# EAGLE schematic proxmark3 (EAGLE 6.4)

## Sheet 1 of 5
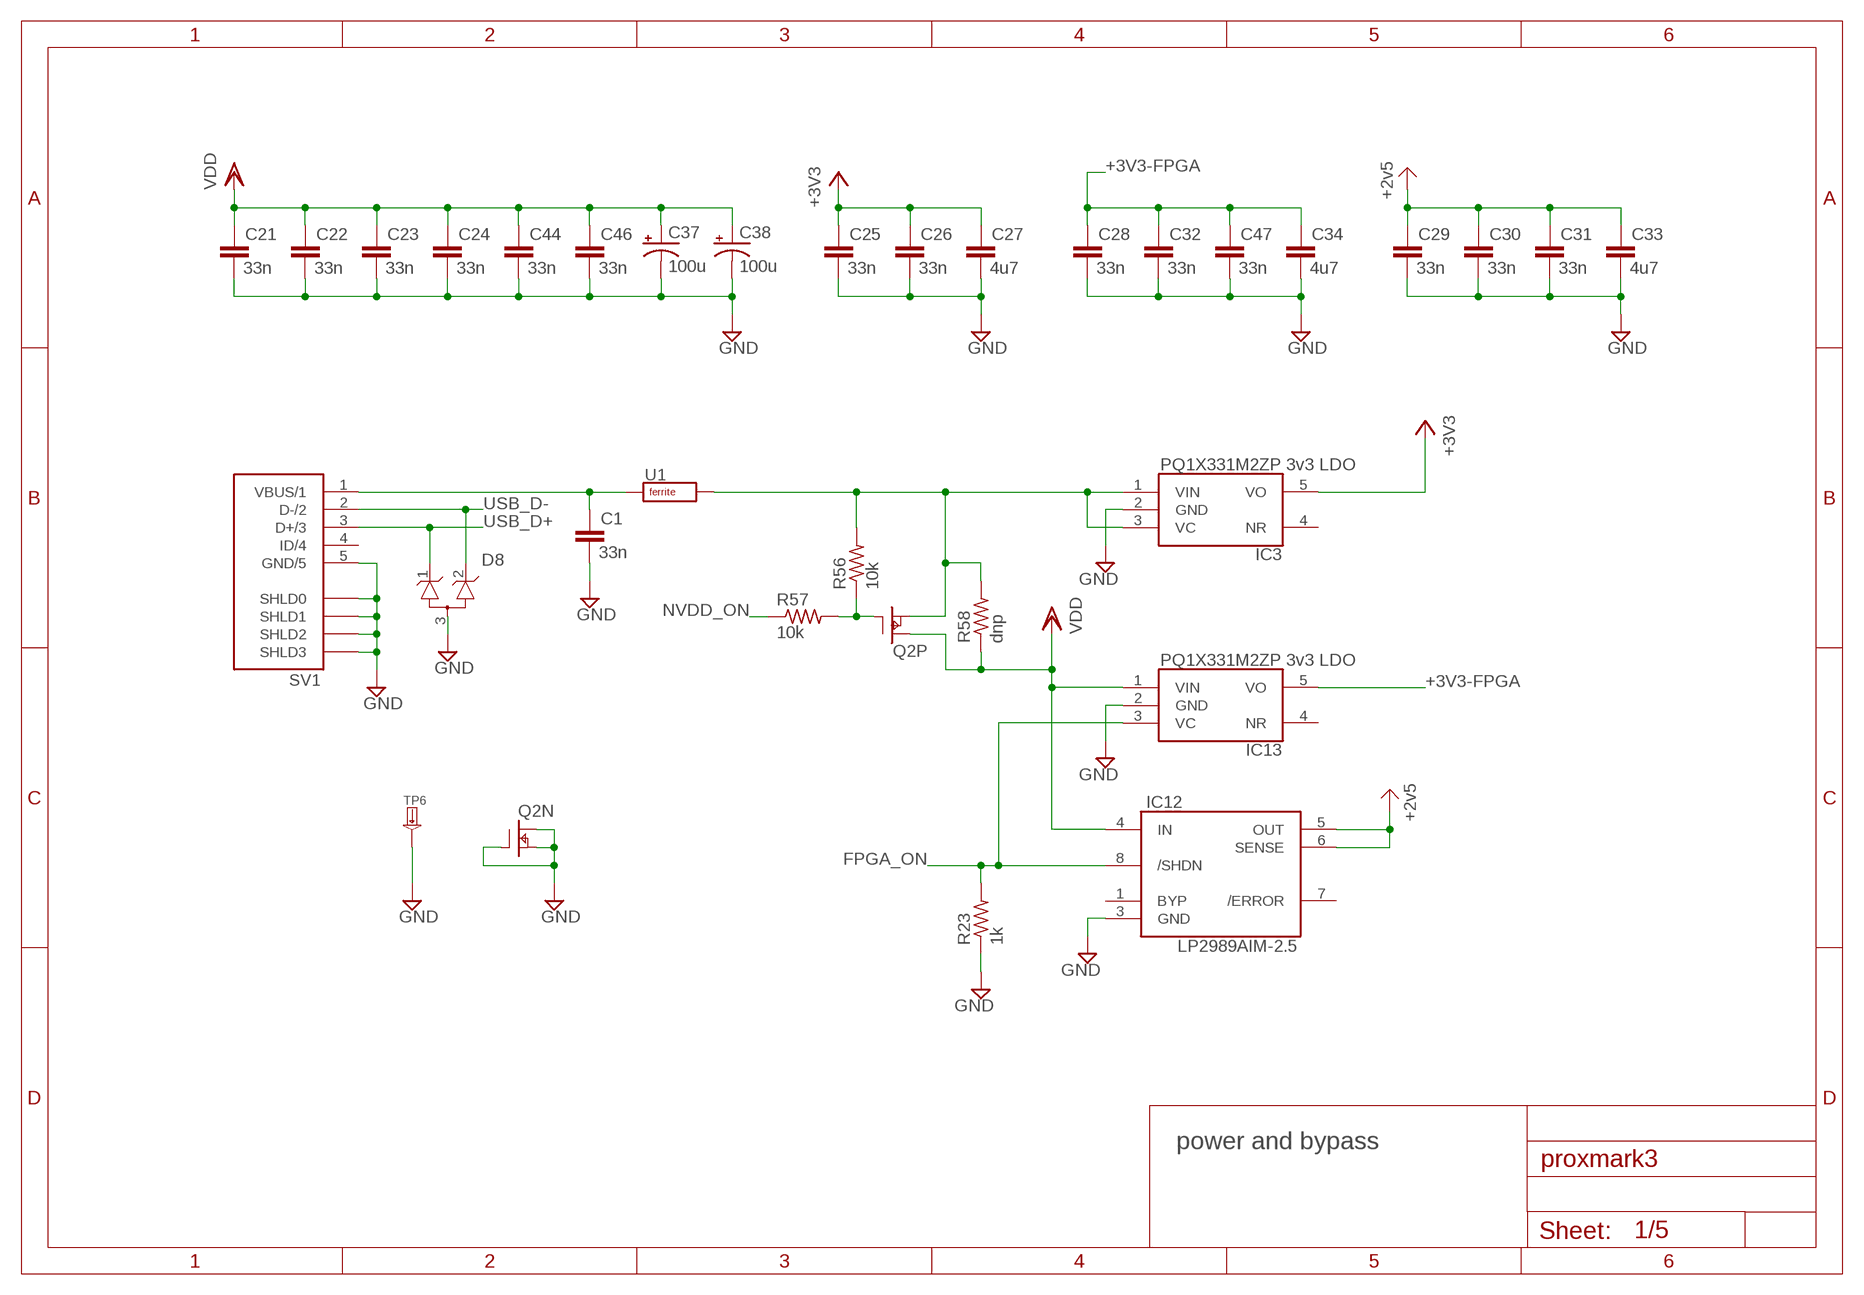
[diagram p0: schematic, sheet 1]

### Parts
C1  33n  CAPACITOR0603  [RLC_0603]
C21  33n  CAPACITOR0603  [RLC_0603]
C22  33n  CAPACITOR0603  [RLC_0603]
C23  33n  CAPACITOR0603  [RLC_0603]
C24  33n  CAPACITOR0603  [RLC_0603]
C25  33n  CAPACITOR0603  [RLC_0603]
C26  33n  CAPACITOR0603  [RLC_0603]
C27  4u7  CAPACITOR1210  [RLC_1210]
C28  33n  CAPACITOR0603  [RLC_0603]
C29  33n  CAPACITOR0603  [RLC_0603]
C30  33n  CAPACITOR0603  [RLC_0603]
C31  33n  CAPACITOR0603  [RLC_0603]
C32  33n  CAPACITOR0603  [RLC_0603]
C33  4u7  CAPACITOR1210  [RLC_1210]
C34  4u7  CAPACITOR1210  [RLC_1210]
C37  100u  CAPACITOR-POLARIZEDALCHIP-MZA-F80  [CAPCAITOR-ELECTROLYTIC-ALCHIP-MZA-F80]
C38  100u  CAPACITOR-POLARIZEDALCHIP-MZA-F80  [CAPCAITOR-ELECTROLYTIC-ALCHIP-MZA-F80]
C44  33n  CAPACITOR0603  [RLC_0603]
C46  33n  CAPACITOR0603  [RLC_0603]
C47  33n  CAPACITOR0603  [RLC_0603]
D8  --MERGED_DUAL-TVS-COMMON-ANODE  [--MERGED_SOT23-3LEAD]
IC3  --MERGED_PQ1X331M2ZP-3V3-LDO-SOT-23-5  [--MERGED_SOT-23-5]
IC12  LP2989AIM-2.5  LP2989-LDOSOIC  [SOIC-8]
IC13  --MERGED_PQ1X331M2ZP-3V3-LDO-SOT-23-5  [--MERGED_SOT-23-5]
Q2  IRF7307  [SOIC-8]
R23  1k  RESISTOR0603  [RLC_0603]
R56  10k  RESISTOR0603  [RLC_0603]
R57  10k  RESISTOR0603  [RLC_0603]
R58  dnp  RESISTOR0603  [RLC_0603]
SV1  USB-MINIB  [USB-MINIB-SMD]
TP6  TESTPADKEYSTONE-PTH  [KEYSTONE-PTH-TESTPOINT-5011]
U1  FERRITE0805  [RLC_0805]

### Nets
+2V5: C29.1 C30.1 C31.1 C33.1 IC12.5(OUT) IC12.6(SENSE) ; supply symbol labelled SUPPLY_2V5 ; also sheet 2
+3V3: C25.1 C26.1 C27.1 IC3.5(VO) ; also sheet 2,3
+3V3-FPGA: C28.1 C32.1 C34.1 C47.1 IC13.5(VO) ; also sheet 2
FPGA_ON: IC12.8(/SHDN) IC13.3(VC) R23.2 ; also sheet 3
GND: C1.2 C21.2 C22.2 C23.2 C24.2 C25.2 C26.2 C27.2 C28.2 C29.2 C30.2 C31.2 C32.2 C33.2 C34.2 C37.- C38.- C44.2 C46.2 C47.2 D8.3(A) IC3.2(GND) IC12.3(GND) IC13.2(GND) Q2.1(N:S) Q2.2(N:G) Q2.8(N:D) R23.1 SV1.5(GND/5) SV1.TAB0(SHLD0) SV1.TAB1(SHLD1) SV1.TAB2(SHLD2) SV1.TAB3(SHLD3) TP6.A ; also sheet 2,3,4,5
N$1: C1.1 SV1.1(VBUS/1) U1.1(A)
N$49: IC3.1(VIN) IC3.3(VC) Q2.3(P:S) R56.2 R58.2 U1.2(B)
NVDD_ON: R57.1 ; also sheet 3
PFETGATE: Q2.4(P:G) R56.1 R57.2
USB_D+: D8.1(K1) SV1.3(D+/3) ; also sheet 3
USB_D-: D8.2(K2) SV1.2(D-/2) ; also sheet 3
VDD: C21.1 C22.1 C23.1 C24.1 C37.+ C38.+ C44.1 C46.1 IC12.4(IN) IC13.1(VIN) Q2.6(P:D) R58.1 ; also sheet 2,4,5
Unconnected: IC3.4(NR) IC12.1(BYP) IC12.7(/ERROR) IC13.4(NR) SV1.4(ID/4)

### Notes on the sheet
- power and bypass

## Sheet 2 of 5
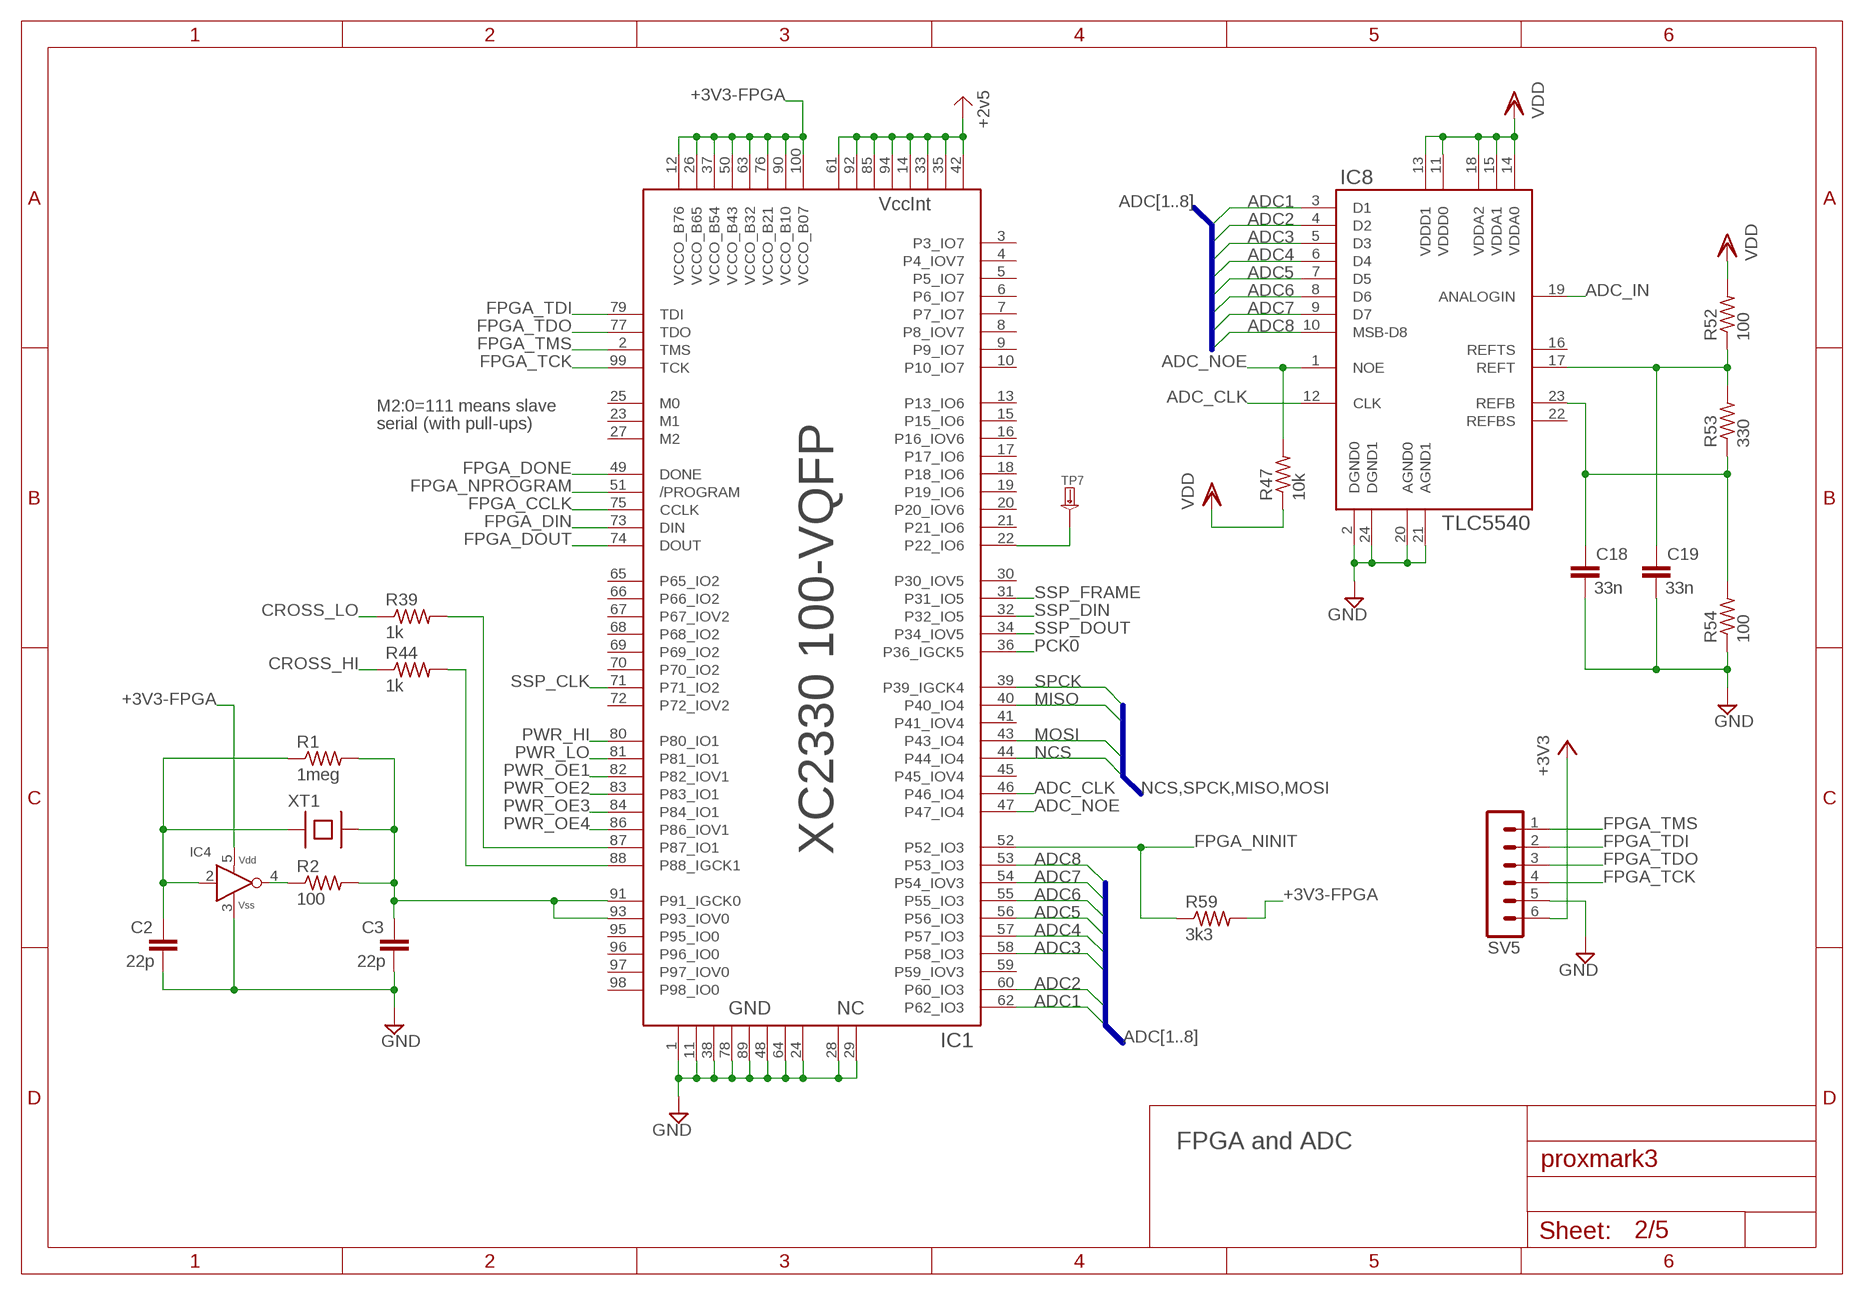
[diagram p1: schematic, sheet 2]

### Parts
C2  22p  CAPACITOR0603  [RLC_0603]
C3  22p  CAPACITOR0603  [RLC_0603]
C18  33n  CAPACITOR0603  [RLC_0603]
C19  33n  CAPACITOR0603  [RLC_0603]
IC1  SPARTAN-II-XC2S30-100-VQFP  [VQFP-100]
IC4  HCU-INVERTER  [SMV-5]
IC8  TLC5540  [TSSOP-24]
R1  1meg  RESISTOR0603  [RLC_0603]
R2  100  RESISTOR0603  [RLC_0603]
R39  1k  RESISTOR0603  [RLC_0603]
R44  1k  RESISTOR0603  [RLC_0603]
R47  10k  RESISTOR0603  [RLC_0603]
R52  100  RESISTOR0603  [RLC_0603]
R53  330  RESISTOR0603  [RLC_0603]
R54  100  RESISTOR0603  [RLC_0603]
R59  3k3  RESISTOR0603  [RLC_0603]
SV5  --MERGED_HEADER-MALE-6X1  [--MERGED_HEADER-MALE-6X1-0.100-UNKEYED]
TP7  TESTPADKEYSTONE-SMD  [KEYSTONE-SMD-TESTPOINT-5015]
XT1  XTAL-SMD-CITIZEN-CS10  [XTAL-SMD-CITIZEN-CS10]

### Nets
+2V5: IC1.14(VCCINT5) IC1.33(VCCINT6) IC1.35(VCCINT7) IC1.42(VCCINT8) IC1.61(VCCINT1) IC1.85(VCCINT3) IC1.92(VCCINT2) IC1.94(VCCINT4) ; supply symbol labelled SUPPLY_2V5 ; also sheet 1
+3V3: SV5.6 ; also sheet 1,3
+3V3-FPGA: IC1.12(VCCO_B76) IC1.26(VCCO_B65) IC1.37(VCCO_B54) IC1.50(VCCO_B43) IC1.63(VCCO_B32) IC1.76(VCCO_B21) IC1.90(VCCO_B10) IC1.100(VCCO_B07) IC4.5(VDD) R59.2 ; also sheet 1
ADC1: IC1.62(P62_IO3) IC8.3(D1)
ADC2: IC1.60(P60_IO3) IC8.4(D2)
ADC3: IC1.58(P58_IO3) IC8.5(D3)
ADC4: IC1.57(P57_IO3) IC8.6(D4)
ADC5: IC1.56(P56_IO3) IC8.7(D5)
ADC6: IC1.55(P55_IO3) IC8.8(D6)
ADC7: IC1.54(P54_IOV3) IC8.9(D7)
ADC8: IC1.53(P53_IO3) IC8.10(MSB-D8)
ADC_CLK: IC1.46(P46_IO4) IC8.12(CLK)
ADC_IN: IC8.19(ANALOGIN) ; also sheet 4
ADC_NOE: IC1.47(P47_IO4) IC8.1(NOE) R47.2
CROSS_HI: R44.1 ; also sheet 4
CROSS_LO: R39.1 ; also sheet 4
FPGA_CCLK: IC1.75(CCLK) ; also sheet 3
FPGA_DIN: IC1.73(DIN) ; also sheet 3
FPGA_DONE: IC1.49(DONE) ; also sheet 3
FPGA_DOUT: IC1.74(DOUT) ; also sheet 3
FPGA_NINIT: IC1.52(P52_IO3) R59.1 ; also sheet 3
FPGA_NPROGRAM: IC1.51(/PROGRAM) ; also sheet 3
FPGA_TCK: IC1.99(TCK) SV5.4
FPGA_TDI: IC1.79(TDI) SV5.2
FPGA_TDO: IC1.77(TDO) SV5.3
FPGA_TMS: IC1.2(TMS) SV5.1
GND: C2.2 C3.2 C18.2 C19.2 IC1.1(GND1) IC1.11(GND2) IC1.24(GND8) IC1.28(NC0) IC1.29(NC1) IC1.38(GND3) IC1.48(GND6) IC1.64(GND7) IC1.78(GND4) IC1.89(GND5) IC4.3(VSS) IC8.2(DGND0) IC8.20(AGND0) IC8.21(AGND1) IC8.24(DGND1) R54.1 SV5.5 ; also sheet 1,3,4,5
MISO: IC1.40(P40_IO4) ; also sheet 3
MOSI: IC1.43(P43_IO4) ; also sheet 3
N$3: IC4.4(Y) R2.1
N$4: C2.1 IC4.2(A) R1.1 XT1.A
N$5: C3.1 IC1.91(P91_IGCK0) IC1.93(P93_IOV0) R1.2 R2.2 XT1.B
N$24: C18.1 IC8.23(REFB) R53.1 R54.2
N$27: IC1.87(P87_IO1) R39.2
N$40: IC1.88(P88_IGCK1) R44.2
N$48: C19.1 IC8.17(REFT) R52.1 R53.2
N$55: IC1.22(P22_IO6) TP7.1
NCS: IC1.44(P44_IO4) ; also sheet 3
PCK0: IC1.36(P36_IGCK5) ; also sheet 3
PWR_HI: IC1.80(P80_IO1) ; also sheet 5
PWR_LO: IC1.81(P81_IO1) ; also sheet 5
PWR_OE1: IC1.82(P82_IOV1) ; also sheet 5
PWR_OE2: IC1.83(P83_IO1) ; also sheet 5
PWR_OE3: IC1.84(P84_IO1) ; also sheet 5
PWR_OE4: IC1.86(P86_IOV1) ; also sheet 5
SPCK: IC1.39(P39_IGCK4) ; also sheet 3
SSP_CLK: IC1.71(P71_IO2) ; also sheet 3
SSP_DIN: IC1.32(P32_IO5) ; also sheet 3
SSP_DOUT: IC1.34(P34_IOV5) ; also sheet 3
SSP_FRAME: IC1.31(P31_IO5) ; also sheet 3
VDD: IC8.11(VDDD0) IC8.13(VDDD1) IC8.14(VDDA0) IC8.15(VDDA1) IC8.18(VDDA2) R47.1 R52.2 ; also sheet 1,4,5
Unconnected: IC1.3(P3_IO7) IC1.4(P4_IOV7) IC1.5(P5_IO7) IC1.6(P6_IO7) IC1.7(P7_IO7) IC1.8(P8_IOV7) IC1.9(P9_IO7) IC1.10(P10_IO7) IC1.13(P13_IO6) IC1.15(P15_IO6) IC1.16(P16_IOV6) IC1.17(P17_IO6) IC1.18(P18_IO6) IC1.19(P19_IO6) IC1.20(P20_IOV6) IC1.21(P21_IO6) IC1.23(M1) IC1.25(M0) IC1.27(M2) IC1.30(P30_IOV5) IC1.41(P41_IOV4) IC1.45(P45_IOV4) IC1.59(P59_IOV3) IC1.65(P65_IO2) IC1.66(P66_IO2) IC1.67(P67_IOV2) IC1.68(P68_IO2) IC1.69(P69_IO2) IC1.70(P70_IO2) IC1.72(P72_IOV2) IC1.95(P95_IO0) IC1.96(P96_IO0) IC1.97(P97_IOV0) IC1.98(P98_IO0) IC8.16(REFTS) IC8.22(REFBS)

### Buses
NCS,SPCK,MISO,MOSI
ADC[1..8]

### Notes on the sheet
- M2:0=111 means slave
- serial (with pull-ups)
- FPGA and ADC

## Sheet 3 of 5
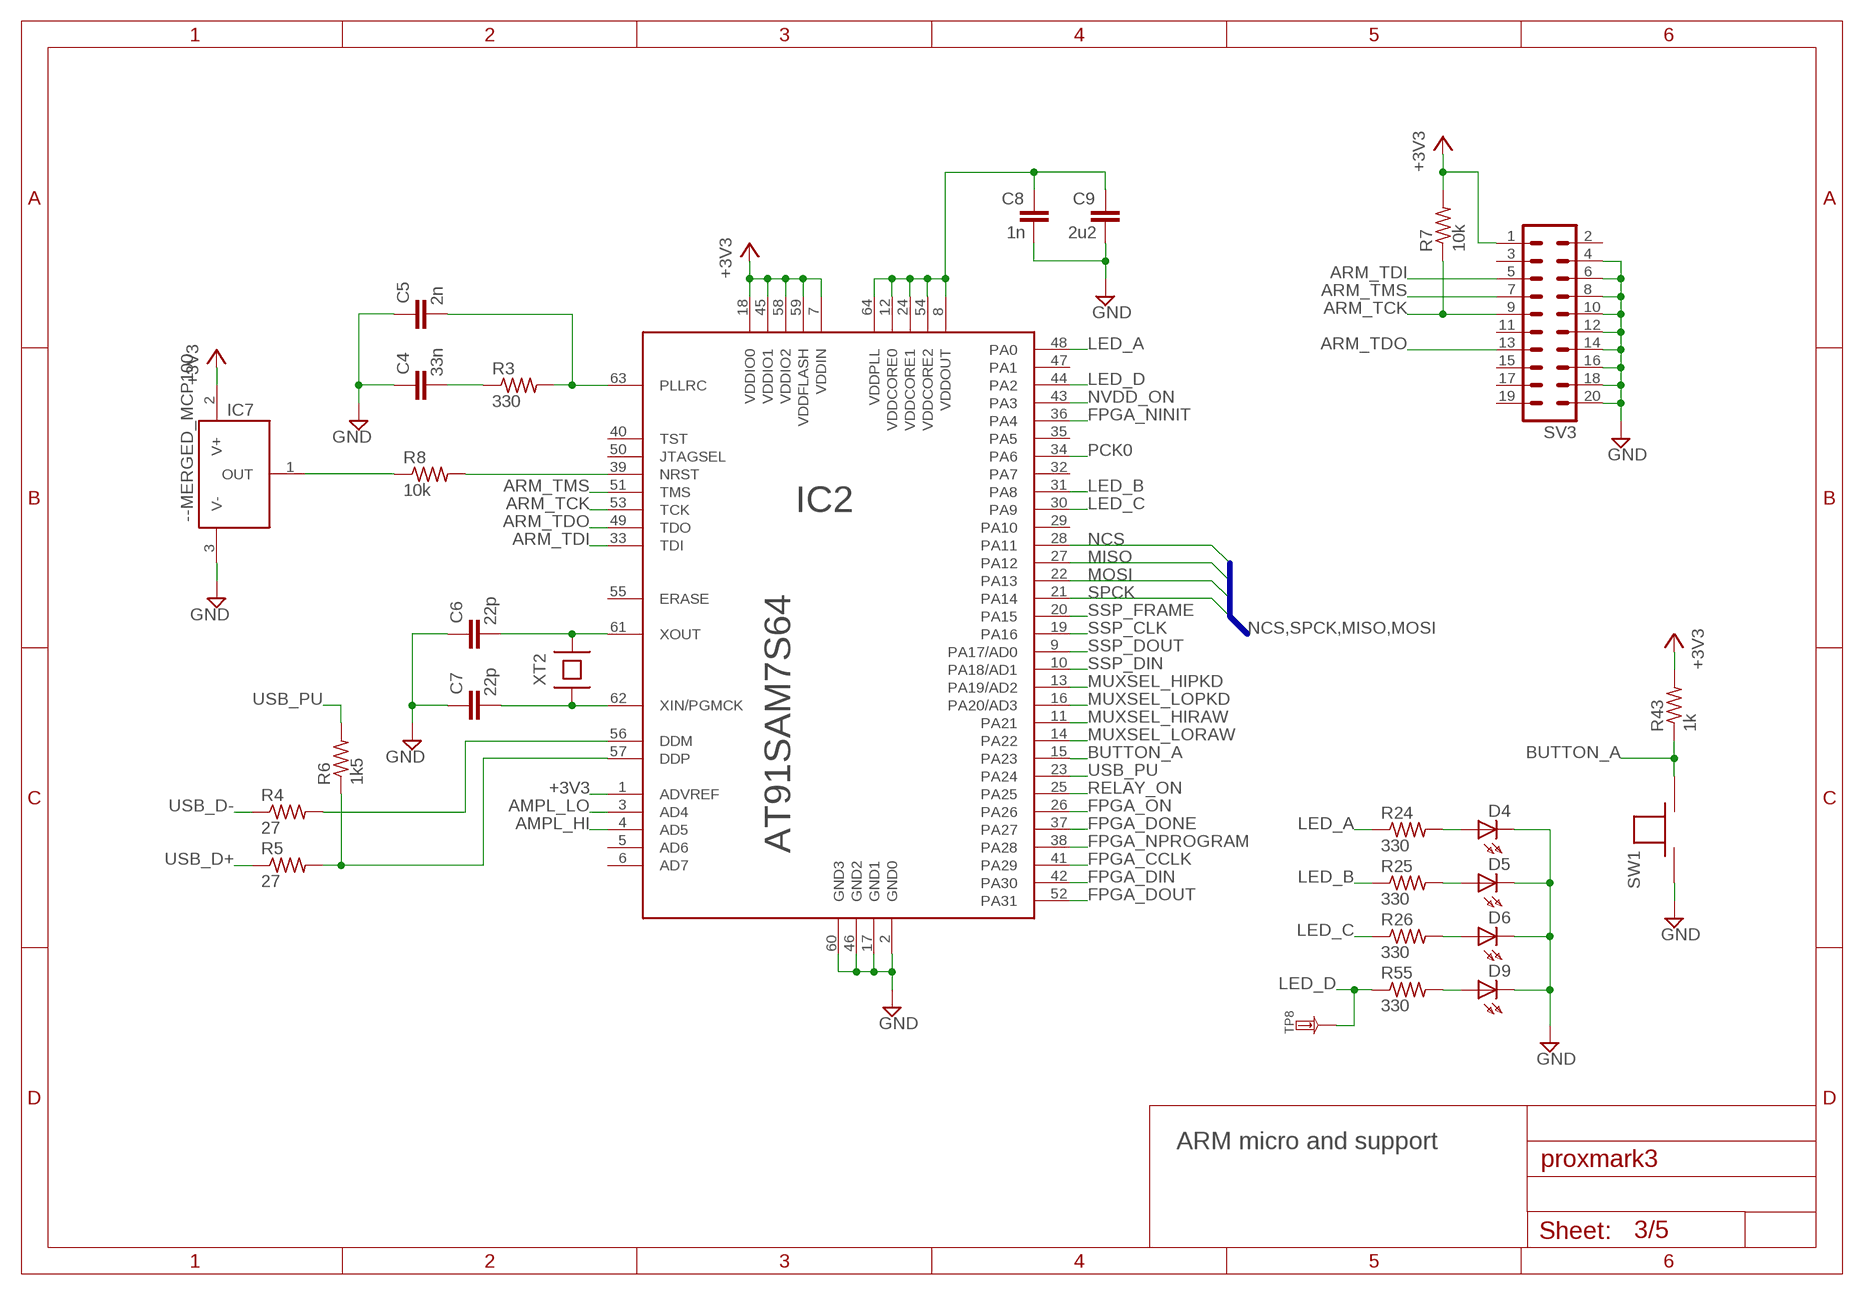
[diagram p2: schematic, sheet 3]

### Parts
C4  33n  CAPACITOR0603  [RLC_0603]
C5  2n  CAPACITOR0603  [RLC_0603]
C6  22p  --MERGED_CAPACITOR0603  [--MERGED_RLC_0603]
C7  22p  --MERGED_CAPACITOR0603  [--MERGED_RLC_0603]
C8  1n  CAPACITOR0603  [RLC_0603]
C9  2u2  CAPACITOR1210  [RLC_1210]
D4  LED  [LED_0603]
D5  LED  [LED_0603]
D6  LED  [LED_0603]
D9  LED  [LED_0603]
IC2  AT91SAM7S64  [LQFP-64]
IC7  --MERGED_MCP100  [--MERGED_SOT23-3LEAD]
R3  330  RESISTOR0603  [RLC_0603]
R4  27  RESISTOR0603  [RLC_0603]
R5  27  RESISTOR0603  [RLC_0603]
R6  1k5  RESISTOR0603  [RLC_0603]
R7  10k  RESISTOR0603  [RLC_0603]
R8  10k  RESISTOR0603  [RLC_0603]
R24  330  RESISTOR0603  [RLC_0603]
R25  330  RESISTOR0603  [RLC_0603]
R26  330  RESISTOR0603  [RLC_0603]
R43  1k  RESISTOR0603  [RLC_0603]
R55  330  RESISTOR0603  [RLC_0603]
SV3  HEADER-MALE-10X2  [HEADER-MALE-10X2-0.100-SHROUDED]
SW1  TACTSWITCH  [TACTSWITCH-SMD-EVQQ1]
TP8  TESTPADKEYSTONE-SMD  [KEYSTONE-SMD-TESTPOINT-5015]
XT2  XTAL-SMD-CITIZEN-CS10  [XTAL-SMD-CITIZEN-CS10]

### Nets
+3V3: IC2.1(ADVREF) IC2.7(VDDIN) IC2.18(VDDIO0) IC2.45(VDDIO1) IC2.58(VDDIO2) IC2.59(VDDFLASH) IC7.2(V+) R7.2 R43.2 SV3.1 ; also sheet 1,2
AMPL_HI: IC2.4(AD5) ; also sheet 4
AMPL_LO: IC2.3(AD4) ; also sheet 4
ARM_TCK: IC2.53(TCK) R7.1 SV3.9
ARM_TDI: IC2.33(TDI) SV3.5
ARM_TDO: IC2.49(TDO) SV3.13
ARM_TMS: IC2.51(TMS) SV3.7
BUTTON_A: IC2.15(PA23) R43.1 SW1.B
FPGA_CCLK: IC2.41(PA29) ; also sheet 2
FPGA_DIN: IC2.42(PA30) ; also sheet 2
FPGA_DONE: IC2.37(PA27) ; also sheet 2
FPGA_DOUT: IC2.52(PA31) ; also sheet 2
FPGA_NINIT: IC2.36(PA4) ; also sheet 2
FPGA_NPROGRAM: IC2.38(PA28) ; also sheet 2
FPGA_ON: IC2.26(PA26) ; also sheet 1
GND: C4.1 C5.1 C6.1 C7.1 C8.2 C9.2 D4.-(C) D5.-(C) D6.-(C) D9.-(C) IC2.2(GND0) IC2.17(GND1) IC2.46(GND2) IC2.60(GND3) IC7.3(V-) SV3.4 SV3.6 SV3.8 SV3.10 SV3.12 SV3.14 SV3.16 SV3.18 SV3.20 SW1.A ; also sheet 1,2,4,5
LED_A: IC2.48(PA0) R24.1
LED_B: IC2.31(PA8) R25.1
LED_C: IC2.30(PA9) R26.1
LED_D: IC2.44(PA2) R55.1 TP8.1
MISO: IC2.27(PA12) ; also sheet 2
MOSI: IC2.22(PA13) ; also sheet 2
MUXSEL_HIPKD: IC2.13(PA19/AD2) ; also sheet 4
MUXSEL_HIRAW: IC2.11(PA21) ; also sheet 4
MUXSEL_LOPKD: IC2.16(PA20/AD3) ; also sheet 4
MUXSEL_LORAW: IC2.14(PA22) ; also sheet 4
N$2: C5.2 IC2.63(PLLRC) R3.2
N$6: C4.2 R3.1
N$7: C6.2 IC2.61(XOUT) XT2.B
N$8: C7.2 IC2.62(XIN/PGMCK) XT2.A
N$9: IC2.39(NRST) R8.2
N$10: C8.1 C9.1 IC2.8(VDDOUT) IC2.12(VDDCORE0) IC2.24(VDDCORE1) IC2.54(VDDCORE2) IC2.64(VDDPLL)
N$11: IC2.56(DDM) R4.2
N$12: IC2.57(DDP) R5.2 R6.1
N$13: IC7.1(OUT) R8.1
N$25: D9.+(A) R55.2
N$28: D6.+(A) R26.2
N$29: D5.+(A) R25.2
N$30: D4.+(A) R24.2
NCS: IC2.28(PA11) ; also sheet 2
NVDD_ON: IC2.43(PA3) ; also sheet 1
PCK0: IC2.34(PA6) ; also sheet 2
RELAY_ON: IC2.25(PA25) ; also sheet 4
SPCK: IC2.21(PA14) ; also sheet 2
SSP_CLK: IC2.19(PA16) ; also sheet 2
SSP_DIN: IC2.10(PA18/AD1) ; also sheet 2
SSP_DOUT: IC2.9(PA17/AD0) ; also sheet 2
SSP_FRAME: IC2.20(PA15) ; also sheet 2
USB_D+: R5.1 ; also sheet 1
USB_D-: R4.1 ; also sheet 1
USB_PU: IC2.23(PA24) R6.2
Unconnected: IC2.5(AD6) IC2.6(AD7) IC2.29(PA10) IC2.32(PA7) IC2.35(PA5) IC2.40(TST) IC2.47(PA1) IC2.50(JTAGSEL) IC2.55(ERASE) SV3.2 SV3.3 SV3.11 SV3.15 SV3.17 SV3.19

### Buses
NCS,SPCK,MISO,MOSI

### Notes on the sheet
- ARM micro and support

## Sheet 4 of 5
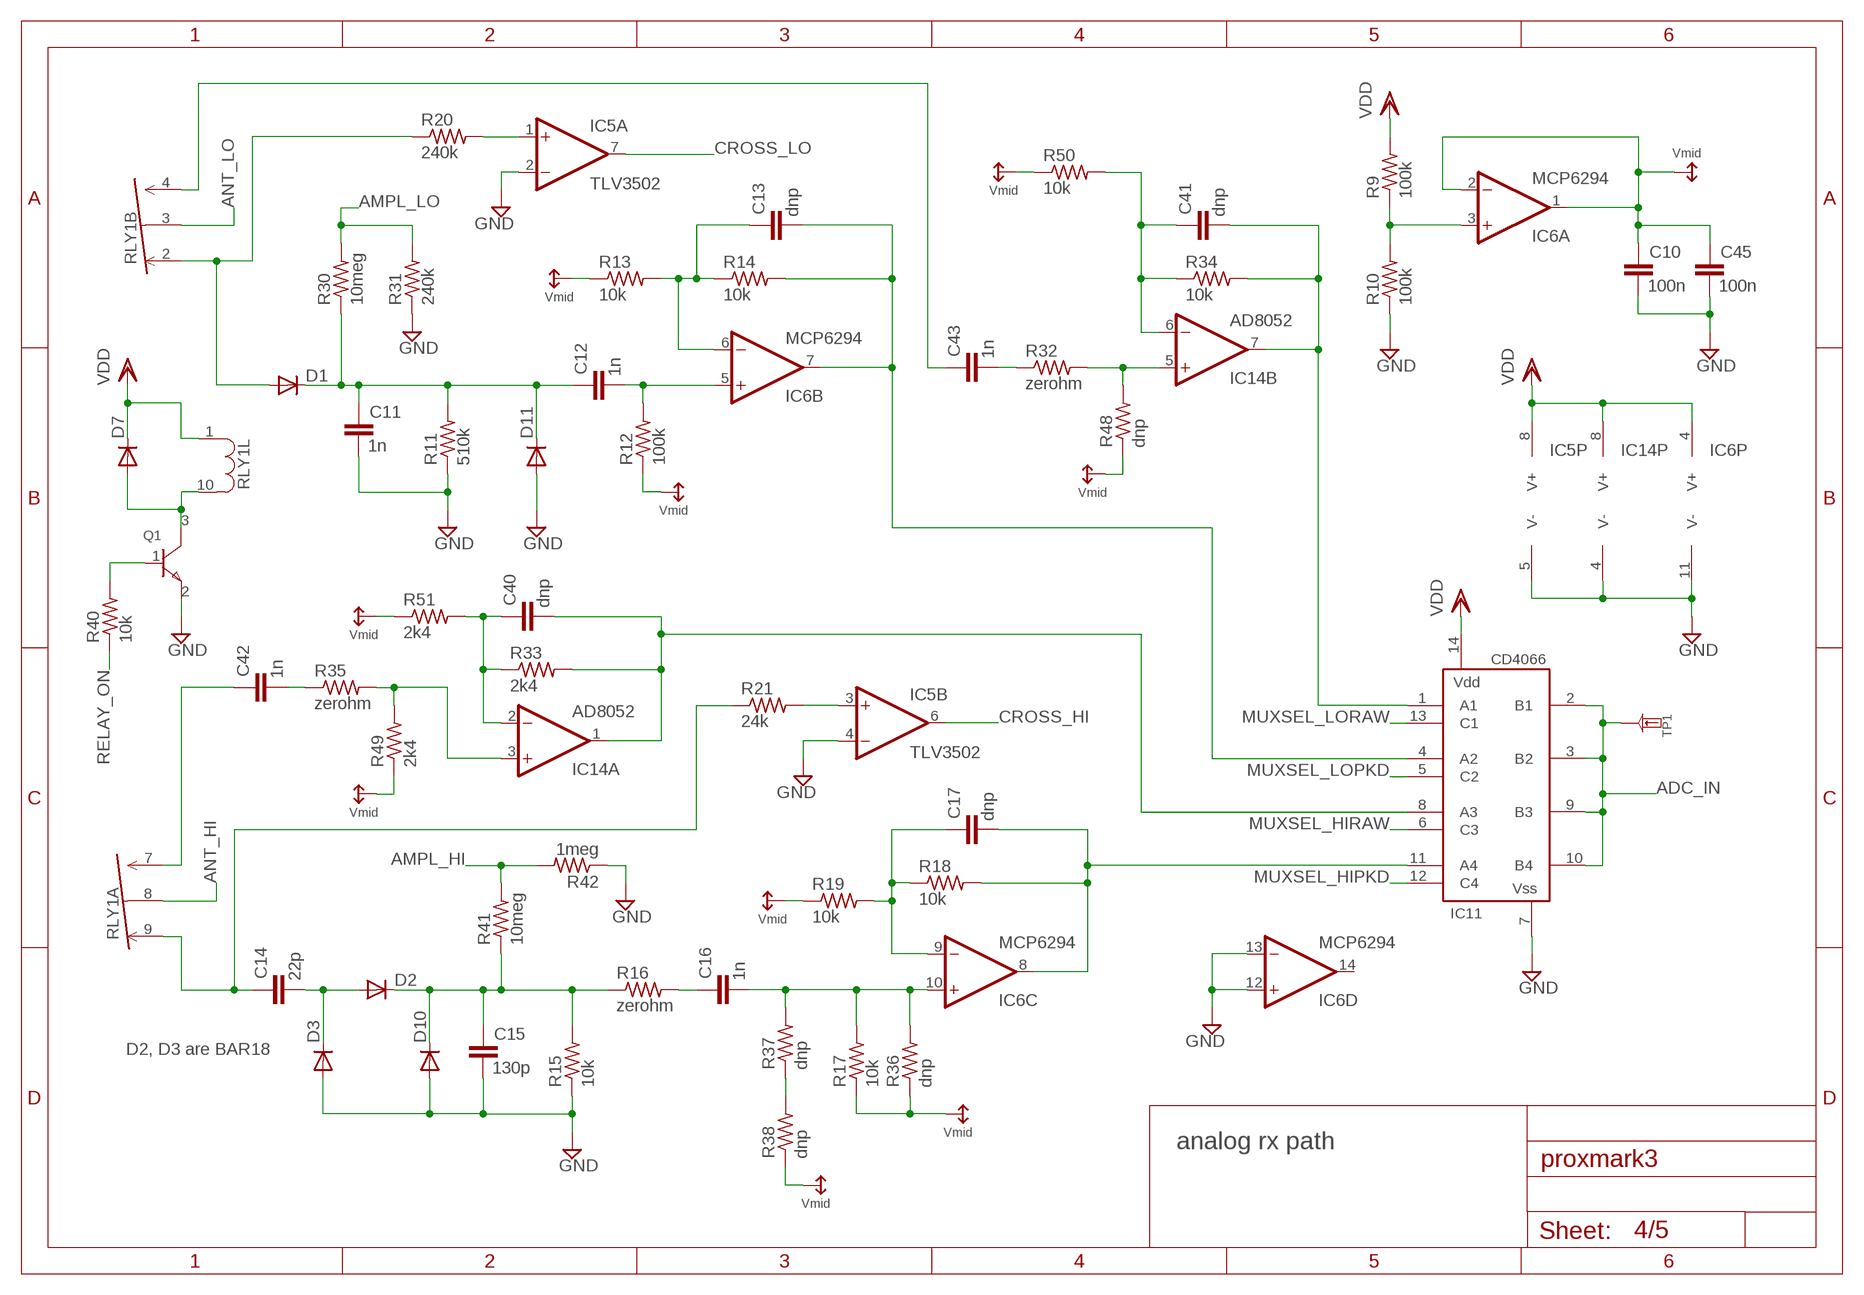
[diagram p3: schematic, sheet 4]

### Parts
C10  100n  CAPACITOR0603  [RLC_0603]
C11  1n  CAPACITOR0603  [RLC_0603]
C12  1n  CAPACITOR0603  [RLC_0603]
C13  dnp  CAPACITOR0603  [RLC_0603]
C14  22p  CAPACITOR0603  [RLC_0603]
C15  130p  CAPACITOR0603  [RLC_0603]
C16  1n  CAPACITOR0603  [RLC_0603]
C17  dnp  CAPACITOR0603  [RLC_0603]
C40  dnp  CAPACITOR0603  [RLC_0603]
C41  dnp  CAPACITOR0603  [RLC_0603]
C42  1n  CAPACITOR0603  [RLC_0603]
C43  1n  CAPACITOR0603  [RLC_0603]
C45  100n  CAPACITOR0603  [RLC_0603]
D1  --MERGED_DIODE-SMD-SOT23  [--MERGED_SOT23-3LEAD]
D2  --MERGED_DIODE-SMD-SOT23  [--MERGED_SOT23-3LEAD]
D3  --MERGED_DIODE-SMD-SOT23  [--MERGED_SOT23-3LEAD]
D7  --MERGED_DIODE-SMD-SOT23  [--MERGED_SOT23-3LEAD]
D10  --MERGED_DIODE-SMD-SOT23  [--MERGED_SOT23-3LEAD]
D11  --MERGED_DIODE-SMD-SOT23  [--MERGED_SOT23-3LEAD]
IC5  TLV3502  COMP-TLV3502SOT-23-8-OR-MSOP-8  [SOT-23-8-OR-MSOP-8]
IC6  MCP6294  OPAMP-TLC2274  [TSSOP-14]
IC11  CD4066  [TSSOP-14]
IC14  AD8052  OPAMP-AD8052  [MSOP8]
Q1  --MERGED_NPN-SOT23-2N3904  [--MERGED_SOT23-3LEAD]
R9  100k  RESISTOR0603  [RLC_0603]
R10  100k  RESISTOR0603  [RLC_0603]
R11  510k  RESISTOR0603  [RLC_0603]
R12  100k  RESISTOR0603  [RLC_0603]
R13  10k  RESISTOR0603  [RLC_0603]
R14  10k  RESISTOR0603  [RLC_0603]
R15  10k  RESISTOR0603  [RLC_0603]
R16  zerohm  RESISTOR0603  [RLC_0603]
R17  10k  RESISTOR0603  [RLC_0603]
R18  10k  RESISTOR0603  [RLC_0603]
R19  10k  RESISTOR0603  [RLC_0603]
R20  240k  RESISTOR0603  [RLC_0603]
R21  24k  RESISTOR0603  [RLC_0603]
R30  10meg  RESISTOR0603  [RLC_0603]
R31  240k  RESISTOR0603  [RLC_0603]
R32  zerohm  RESISTOR0603  [RLC_0603]
R33  2k4  RESISTOR0603  [RLC_0603]
R34  10k  RESISTOR0603  [RLC_0603]
R35  zerohm  RESISTOR0603  [RLC_0603]
R36  dnp  RESISTOR0603  [RLC_0603]
R37  dnp  RESISTOR0603  [RLC_0603]
R38  dnp  RESISTOR0603  [RLC_0603]
R40  10k  RESISTOR0603  [RLC_0603]
R41  10meg  RESISTOR0603  [RLC_0603]
R42  1meg  RESISTOR0603  [RLC_0603]
R48  dnp  RESISTOR0603  [RLC_0603]
R49  2k4  RESISTOR0603  [RLC_0603]
R50  10k  RESISTOR0603  [RLC_0603]
R51  2k4  RESISTOR0603  [RLC_0603]
RLY1  --MERGED_RELAY-DPDT  [--MERGED_TQ-SMD-RELAY]
TP1  TESTPADKEYSTONE-SMD  [KEYSTONE-SMD-TESTPOINT-5015]

### Nets
ADC_IN: IC11.2(B1) IC11.3(B2) IC11.9(B3) IC11.10(B4) TP1.1 ; also sheet 2
ADCDR_HI: C17.2 IC6.8(C:OUT) IC11.11(A4) R18.2
ADCDR_LO: C13.2 IC6.7(B:OUT) IC11.4(A2) R14.2
AMPL_HI: R41.2 R42.2 ; also sheet 3
AMPL_LO: R30.2 R31.2 ; also sheet 3
ANT_HI: RLY1.8(A:COM) ; also sheet 5
ANT_LO: RLY1.3(B:COM) ; also sheet 5
CROSS_HI: IC5.6(B:OUT) ; also sheet 2
CROSS_LO: IC5.7(A:OUT) ; also sheet 2
GND: C10.2 C11.2 C15.2 C45.2 D3.1(A) D10.1(A) D11.1(A) IC5.2(A:-IN) IC5.4(B:-IN) IC5.5(P:V-) IC6.11(P:V-) IC6.12(D:+IN) IC6.13(D:-IN) IC11.7(VSS) IC14.4(P:V-) Q1.2(E) R10.1 R11.1 R15.1 R31.1 R42.1 ; also sheet 1,2,3,5
MUXSEL_HIPKD: IC11.12(C4) ; also sheet 3
MUXSEL_HIRAW: IC11.6(C3) ; also sheet 3
MUXSEL_LOPKD: IC11.5(C2) ; also sheet 3
MUXSEL_LORAW: IC11.13(C1) ; also sheet 3
N$14: IC6.3(A:+IN) R9.1 R10.2
N$15: C17.1 IC6.9(C:-IN) R18.1 R19.2
N$16: C12.2 IC6.5(B:+IN) R12.2
N$17: C13.1 IC6.6(B:-IN) R13.2 R14.1
N$18: C16.1 R16.2
N$19: C11.1 C12.1 D1.3(C) D11.3(C) R11.2 R30.1
N$20: C14.2 D2.1(A) D3.3(C)
N$21: C15.1 D2.3(C) D10.3(C) R15.2 R16.1 R41.1
N$22: C16.2 IC6.10(C:+IN) R17.2 R36.2 R37.2
N$23: IC5.1(A:+IN) R20.2
N$26: IC5.3(B:+IN) R21.2
N$35: D7.1(A) Q1.3(C) RLY1.10
N$36: C14.1 R21.1 RLY1.9(A:NC)
N$37: C42.1 RLY1.7(A:NO)
N$38: Q1.1(B) R40.2
N$39: D1.1(A) R20.1 RLY1.2(B:NC)
N$43: C41.2 IC11.1(A1) IC14.7(B:OUT) R34.2
N$46: C43.1 RLY1.4(B:NO)
N$47: IC14.3(A:+IN) R35.2 R49.2
N$50: C43.2 R32.1
N$51: C42.2 R35.1
N$52: C40.1 IC14.2(A:-IN) R33.1 R51.2
N$53: C41.1 IC14.6(B:-IN) R34.1 R50.2
N$54: IC14.5(B:+IN) R32.2 R48.2
N$56: R37.1 R38.2
RAW_HI: C40.2 IC11.8(A3) IC14.1(A:OUT) R33.2
RELAY_ON: R40.1 ; also sheet 3
VDD: D7.3(C) IC5.8(P:V+) IC6.4(P:V+) IC11.14(VDD) IC14.8(P:V+) R9.2 RLY1.1 ; also sheet 1,2,5
VMID: C10.1 C45.1 IC6.1(A:OUT) IC6.2(A:-IN) R12.1 R13.1 R17.1 R19.1 R36.1 R38.1 R48.1 R49.1 R50.1 R51.1 ; supply symbol labelled SUPPLY_VMID
Unconnected: IC6.14(D:OUT)

### Notes on the sheet
- D2, D3 are BAR18
- analog rx path

## Sheet 5 of 5
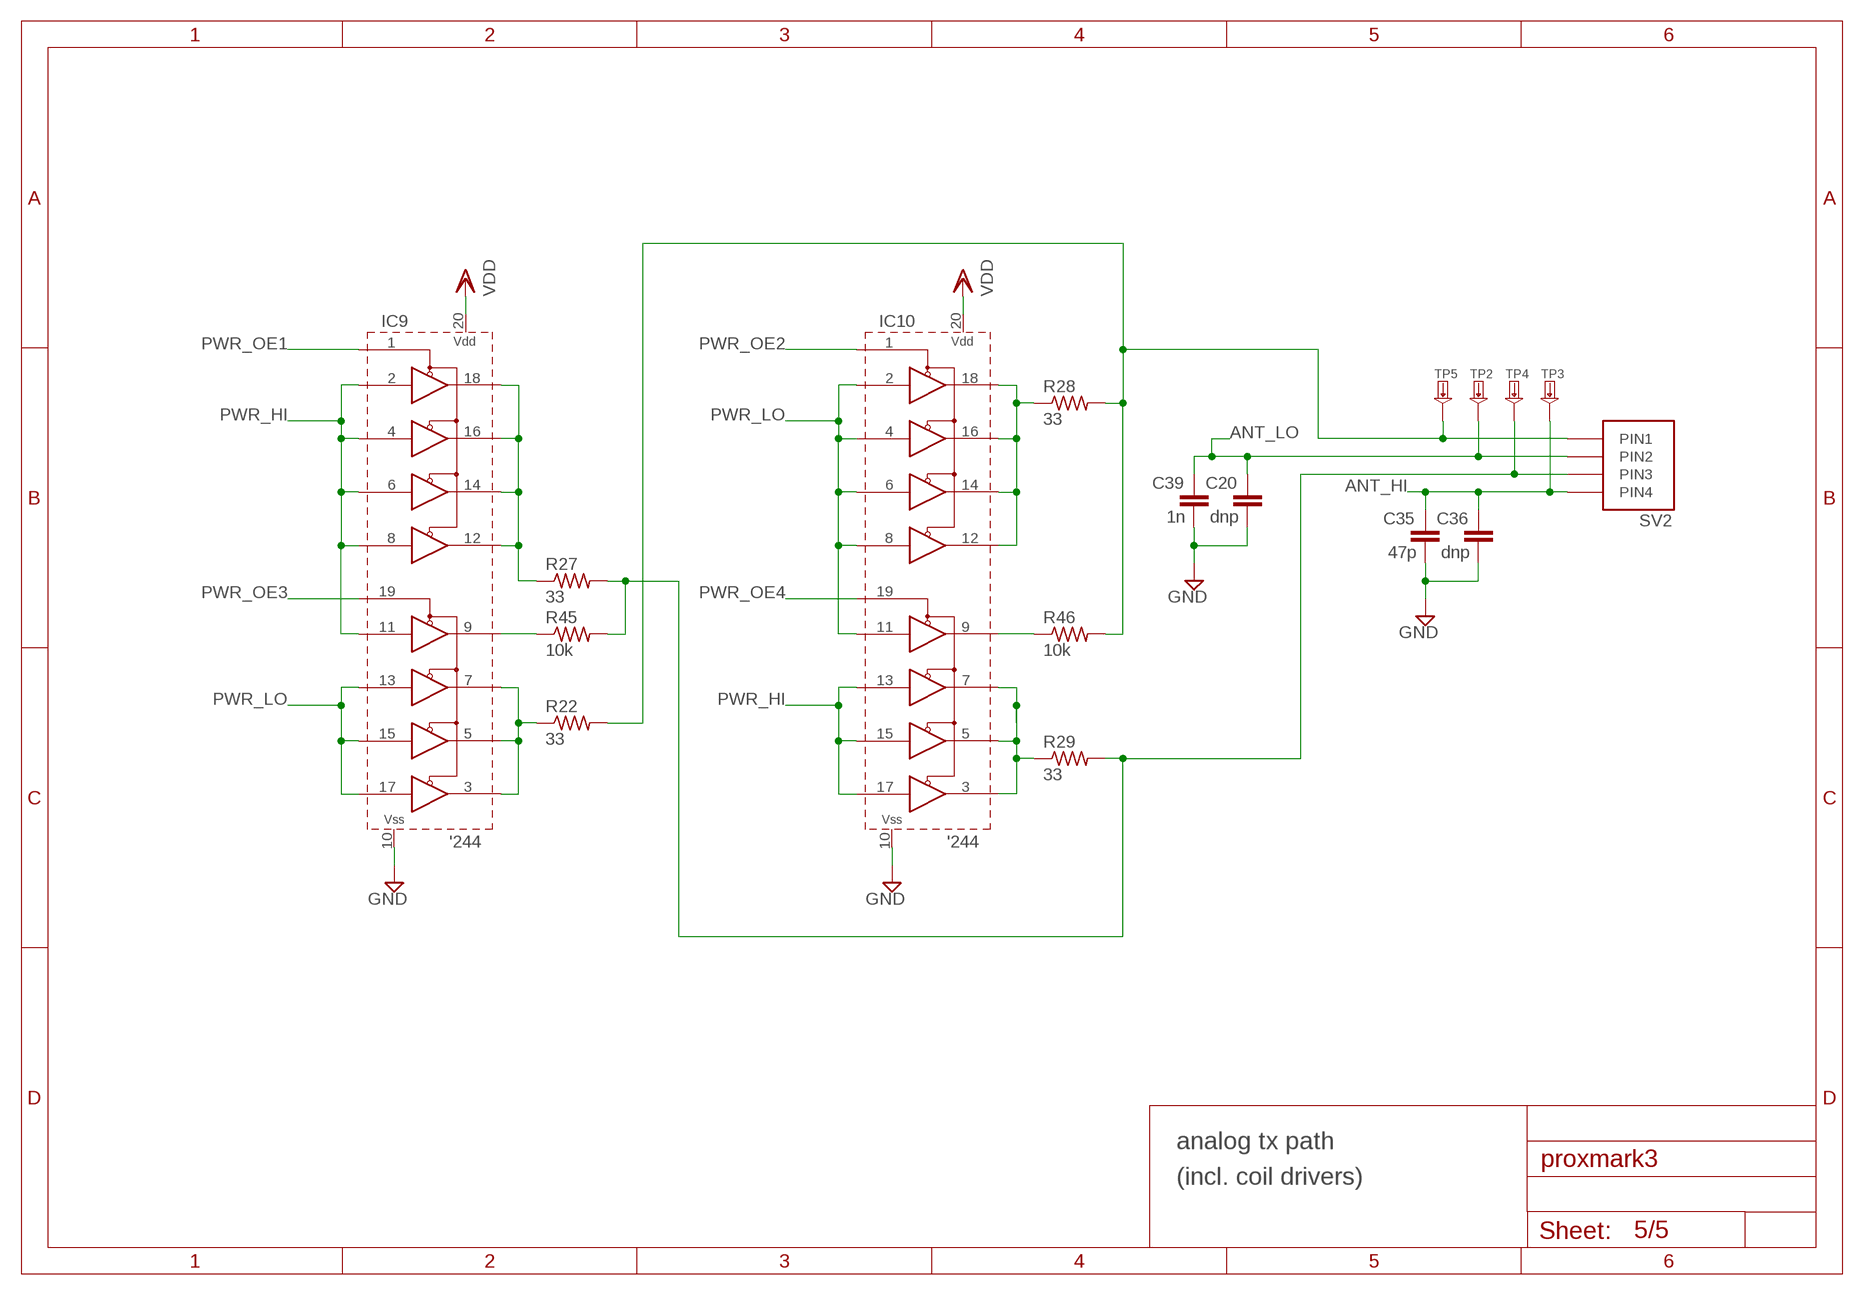
[diagram p4: schematic, sheet 5]

### Parts
C20  dnp  CAPACITOR0603  [RLC_0603]
C35  47p  CAPACITOR0603  [RLC_0603]
C36  dnp  CAPACITOR0603  [RLC_0603]
C39  1n  CAPACITOR0603  [RLC_0603]
IC9  74XX244-OCTAL-TRISTATE-BUFFERS  [TSSOP-20]
IC10  74XX244-OCTAL-TRISTATE-BUFFERS  [TSSOP-20]
R22  33  RESISTOR0603  [RLC_0603]
R27  33  RESISTOR0603  [RLC_0603]
R28  33  RESISTOR0603  [RLC_0603]
R29  33  RESISTOR0603  [RLC_0603]
R45  10k  RESISTOR0603  [RLC_0603]
R46  10k  RESISTOR0603  [RLC_0603]
SV2  HIROSE-MQ172-4POS  [HIROSE-MQ172-4POS]
TP2  TESTPADKEYSTONE-SMD  [KEYSTONE-SMD-TESTPOINT-5015]
TP3  TESTPADKEYSTONE-SMD  [KEYSTONE-SMD-TESTPOINT-5015]
TP4  TESTPADKEYSTONE-SMD  [KEYSTONE-SMD-TESTPOINT-5015]
TP5  TESTPADKEYSTONE-SMD  [KEYSTONE-SMD-TESTPOINT-5015]

### Nets
ANT_HI: C35.1 C36.1 SV2.4(PIN4) TP3.1 ; also sheet 4
ANT_LO: C20.1 C39.1 SV2.2(PIN2) TP2.1 ; also sheet 4
GND: C20.2 C35.2 C36.2 C39.2 IC9.10(VSS) IC10.10(VSS) ; also sheet 1,2,3,4
N$31: R27.2 R29.2 R45.2 SV2.3(PIN3) TP4.1
N$32: R22.2 R28.2 R46.2 SV2.1(PIN1) TP5.1
N$33: IC9.12(1Y4) IC9.14(1Y3) IC9.16(1Y2) IC9.18(1Y1) R27.1
N$34: IC10.12(1Y4) IC10.14(1Y3) IC10.16(1Y2) IC10.18(1Y1) R28.1
N$41: IC9.3(2Y4) IC9.5(2Y3) IC9.7(2Y2) R22.1
N$42: IC10.3(2Y4) IC10.5(2Y3) IC10.7(2Y2) R29.1
N$44: IC9.9(2Y1) R45.1
N$45: IC10.9(2Y1) R46.1
PWR_HI: IC9.2(1A1) IC9.4(1A2) IC9.6(1A3) IC9.8(1A4) IC9.11(2A1) IC10.13(2A2) IC10.15(2A3) IC10.17(2A4) ; also sheet 2
PWR_LO: IC9.13(2A2) IC9.15(2A3) IC9.17(2A4) IC10.2(1A1) IC10.4(1A2) IC10.6(1A3) IC10.8(1A4) IC10.11(2A1) ; also sheet 2
PWR_OE1: IC9.1(1NOE) ; also sheet 2
PWR_OE2: IC10.1(1NOE) ; also sheet 2
PWR_OE3: IC9.19(2NOE) ; also sheet 2
PWR_OE4: IC10.19(2NOE) ; also sheet 2
VDD: IC9.20(VDD) IC10.20(VDD) ; also sheet 1,2,4

### Notes on the sheet
- analog tx path
- (incl. coil drivers)

## Library data of the parts
C1-C5 C8-C36 C39-C47 =   merged:CAPACITOR
C6 C7 = proxmark3:--MERGED_CAPACITOR
C37 C38 =   merged:CAPACITOR-POLARIZED
D1-D3 D7 D10 D11 = proxmark3:--MERGED_DIODE-SMD-SOT23
D4-D6 D9 =   merged:LED
D8 = proxmark3:--MERGED_DUAL-TVS-COMMON-ANODE
IC1 =   merged:SPARTAN-II-XC2S30-100-VQFP
IC2 =   merged:AT91SAM7S64
IC3 IC13 = proxmark3:--MERGED_PQ1X331M2ZP-3V3-LDO-SOT-23-5
IC4 =   merged:HCU-INVERTER
IC5 =   merged:COMP-TLV3502
IC6 =   merged:OPAMP-TLC2274
IC7 = proxmark3:--MERGED_MCP100
IC8 =   merged:TLC5540
IC9 IC10 =   merged:74XX244-OCTAL-TRISTATE-BUFFERS
IC11 =   merged:CD4066
IC12 =   merged:LP2989-LDO
IC14 =   merged:OPAMP-AD8052
Q1 = proxmark3:--MERGED_NPN-SOT23-2N3904
Q2 =   merged:IRF7307
R1-R59 =   merged:RESISTOR
RLY1 = proxmark3:--MERGED_RELAY-DPDT
SV1 =   merged:USB-MINIB
SV2 =   merged:HIROSE-MQ172-4POS
SV3 =   merged:HEADER-MALE-10X2
SV5 = proxmark3:--MERGED_HEADER-MALE-6X1
SW1 =   merged:TACTSWITCH
TP1-TP8 =   merged:TESTPAD
U1 =   merged:FERRITE
XT1 XT2 =   merged:XTAL-SMD-CITIZEN-CS10